# Altium project PCB_Project_1.PrjPcb
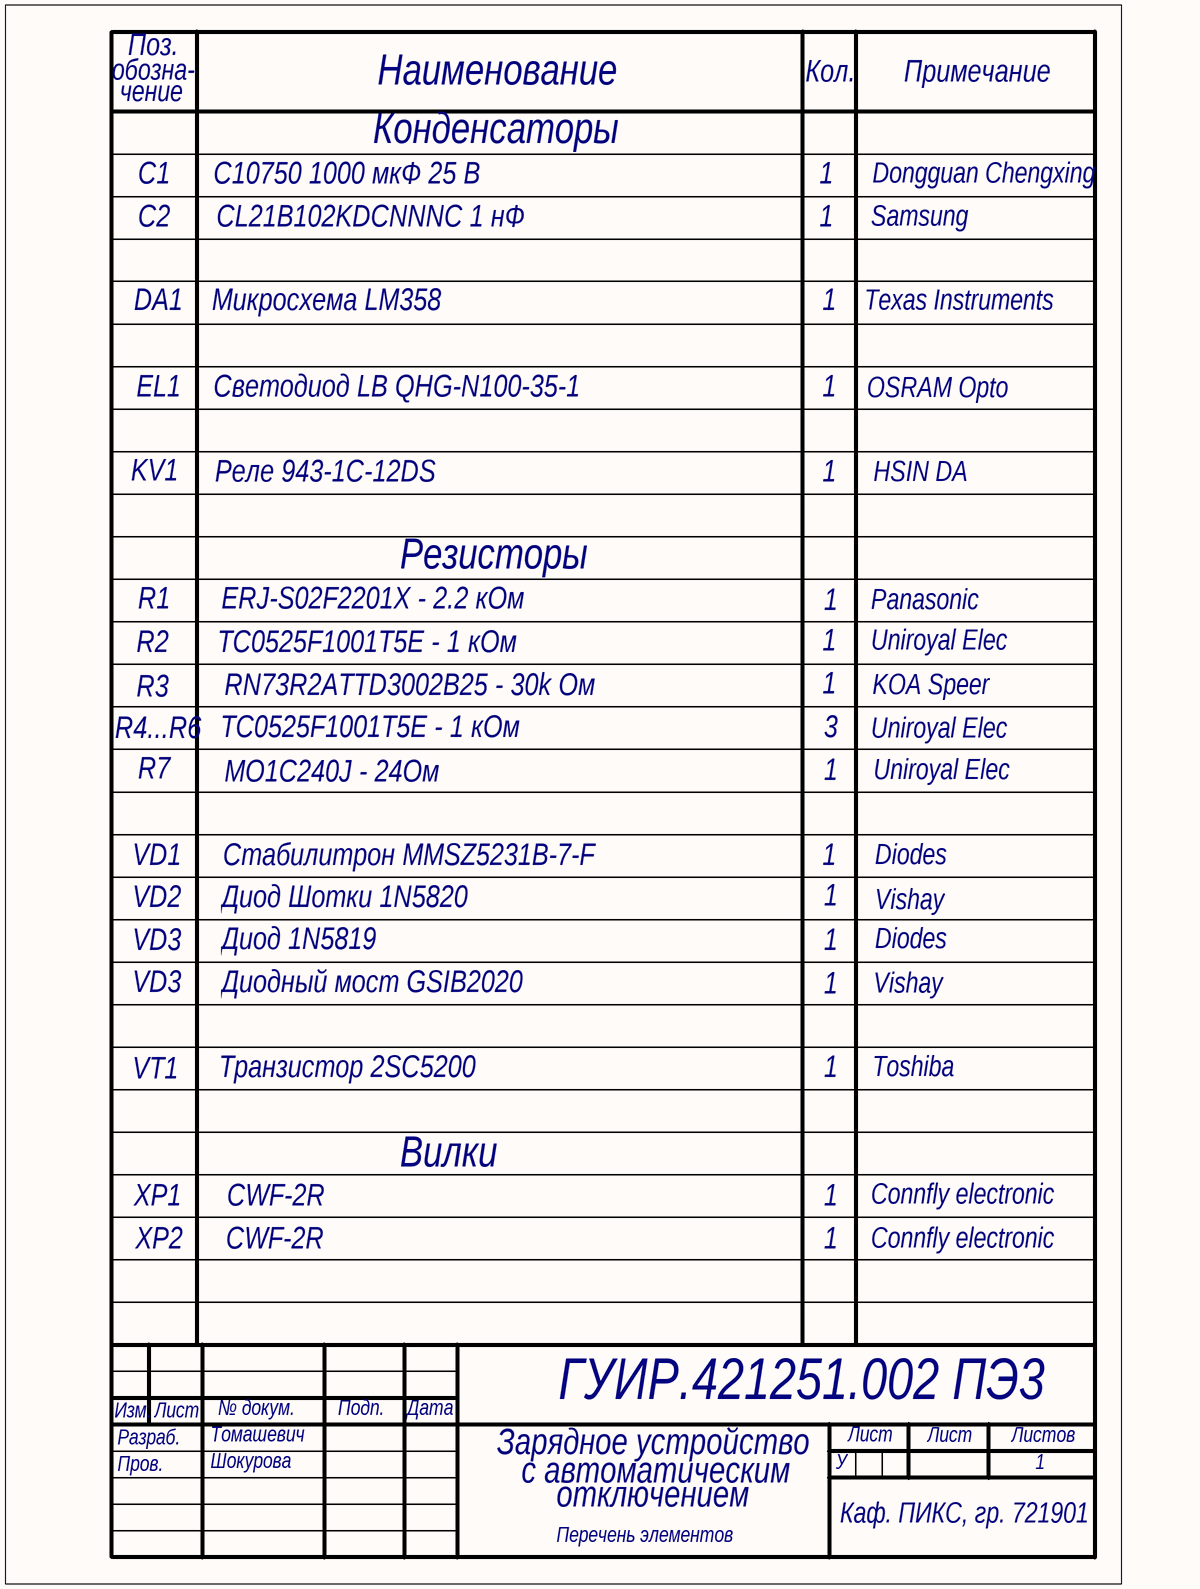
[diagram p0: Perechen_Elementov_KRAC_last.schdoc]
4 sheets, 41 parts. Net scope: global (net labels, ports and power ports of the same name join across sheets).
Sheets:
  Perechen_Elementov_KRAC_last.schdoc
  Perechen_Elementov_Kursovoy_PRT.schdoc
  dzmitry_tamashevich_schema.SchDoc
  Kursovoy_PRT.SchDoc

## Sheet Perechen_Elementov_KRAC_last.schdoc
size 209 x 297 mm

### Notes on the sheet
- Поз.
- обозна-
- чение
- Наименование
- Кол.
- Примечание
- С1
- C10750 1000 мкФ 25 В
- Конденсаторы
- 1
- Dongguan Chengxing
- С2
- CL21B102KDCNNNC 1 нФ
- Samsung
- DA1
- Микросхема LM358
- Texas Instruments
- EL1
- Светодиод LB QHG-N100-35-1
- OSRAM Opto
- KV1
- Реле 943-1C-12DS
- HSIN DA
- Резисторы
- R2
- R1
- TC0525F1001T5E - 1 кОм
- ERJ-S02F2201X - 2.2 кОм
- Uniroyal Elec
- Panasonic
- R3
- RN73R2ATTD3002B25 - 30k Ом
- KOA Speer
- R4...R6
- R7
- MO1C240J - 24Ом
- 3
- VD1
- Стабилитрон MMSZ5231B-7-F
- Diodes
- VD2
- Диод Шотки 1N5820
- Vishay
- VD3
- Диод 1N5819
- Диодный мост GSIB2020
- VT1
- Транзистор 2SC5200
- Toshiba
- Вилки
- Connfly electronic
- XP1
- XP2
- CWF-2R
- ГУИР.421251.002 ПЭ3
- Изм.
- Разраб.
- Пров.
- Лист
- Томашевич
- Шокурова
- № докум.
- Подп.
- Дата
- Зарядное устройство
- У
- Листов
- с автоматическим
- Перечень элементов
- отключением
- Каф. ПИКС, гр. 721901

## Sheet Perechen_Elementov_Kursovoy_PRT.schdoc
size 209 x 297 mm
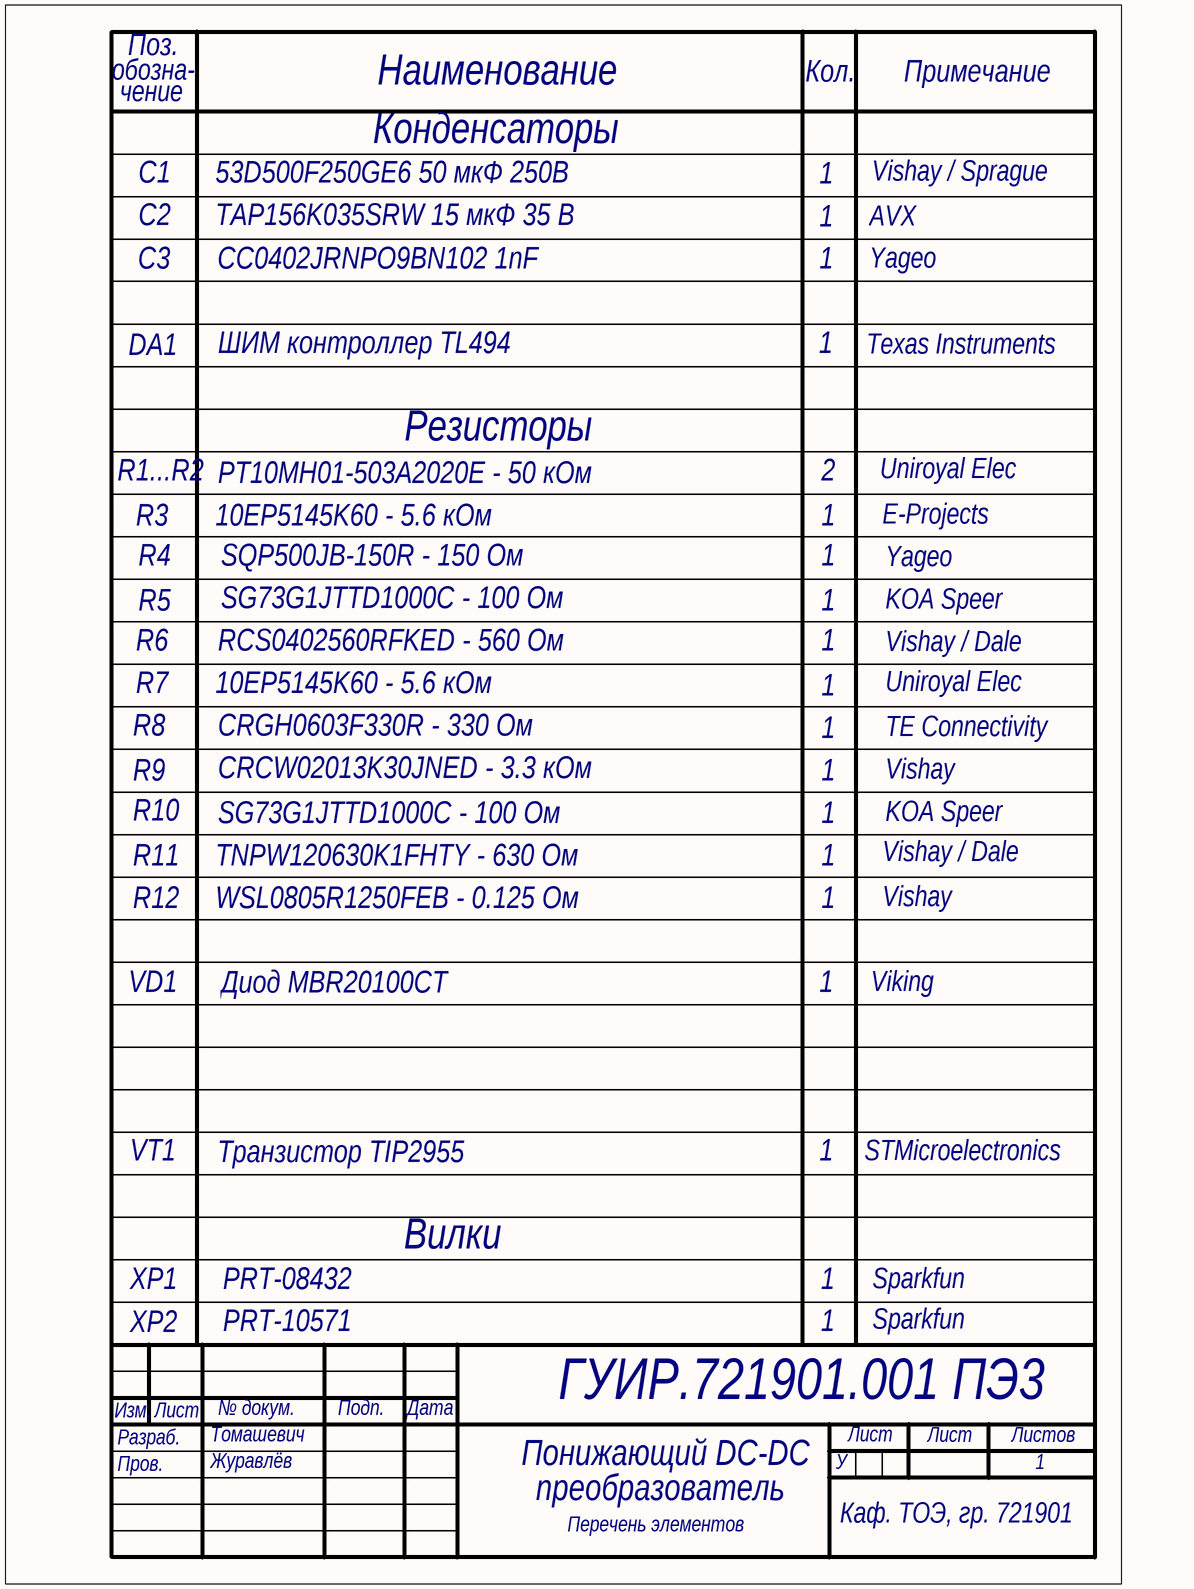
[diagram p1: Perechen_Elementov_Kursovoy_PRT.schdoc]

### Notes on the sheet
- Поз.
- обозна-
- чение
- Наименование
- Кол.
- Примечание
- С1
- 53D500F250GE6 50 мкФ 250В
- Конденсаторы
- 1
- Vishay / Sprague
- С2
- TAP156K035SRW 15 мкФ 35 В
- AVX
- С3
- CC0402JRNPO9BN102 1nF
- Yageo
- DA1
- ШИМ контроллер TL494
- Texas Instruments
- Резисторы
- R1...R2
- R3
- 10EP5145K60 - 5.6 кОм
- PT10MH01-503A2020E - 50 кОм
- 2
- Uniroyal Elec
- E-Projects
- R4
- SQP500JB-150R - 150 Ом
- R6
- R5
- RCS0402560RFKED - 560 Ом
- SG73G1JTTD1000C - 100 Ом
- KOA Speer
- Vishay / Dale
- R7
- R9
- R8
- CRGH0603F330R - 330 Ом
- CRCW02013K30JNED - 3.3 кОм
- TE Connectivity
- Vishay
- R10
- R11
- TNPW120630K1FHTY - 630 Ом
- R12
- WSL0805R1250FEB - 0.125 Ом
- VD1
- Диод MBR20100CT
- Viking
- VT1
- Транзистор TIP2955
- STMicroelectronics
- Вилки
- XP1
- XP2
- PRT-08432
- PRT-10571
- Sparkfun
- ГУИР.721901.001 ПЭ3
- Изм.
- Разраб.
- Пров.
- Лист
- Томашевич
- Журавлёв
- № докум.
- Подп.
- Дата
- Понижающий DC-DC
- У
- Листов
- преобразователь
- Перечень элементов
- Каф. ТОЭ, гр. 721901

## Sheet dzmitry_tamashevich_schema.SchDoc
size 420 x 297 mm; CheckedBy: Шокурова; Author: Томашевич; Address1: Address1; Address2: Address2; Address3: Address3; Address4: Address4; SheetTotal: 1; Scale: 1:1; Letter1Column: T
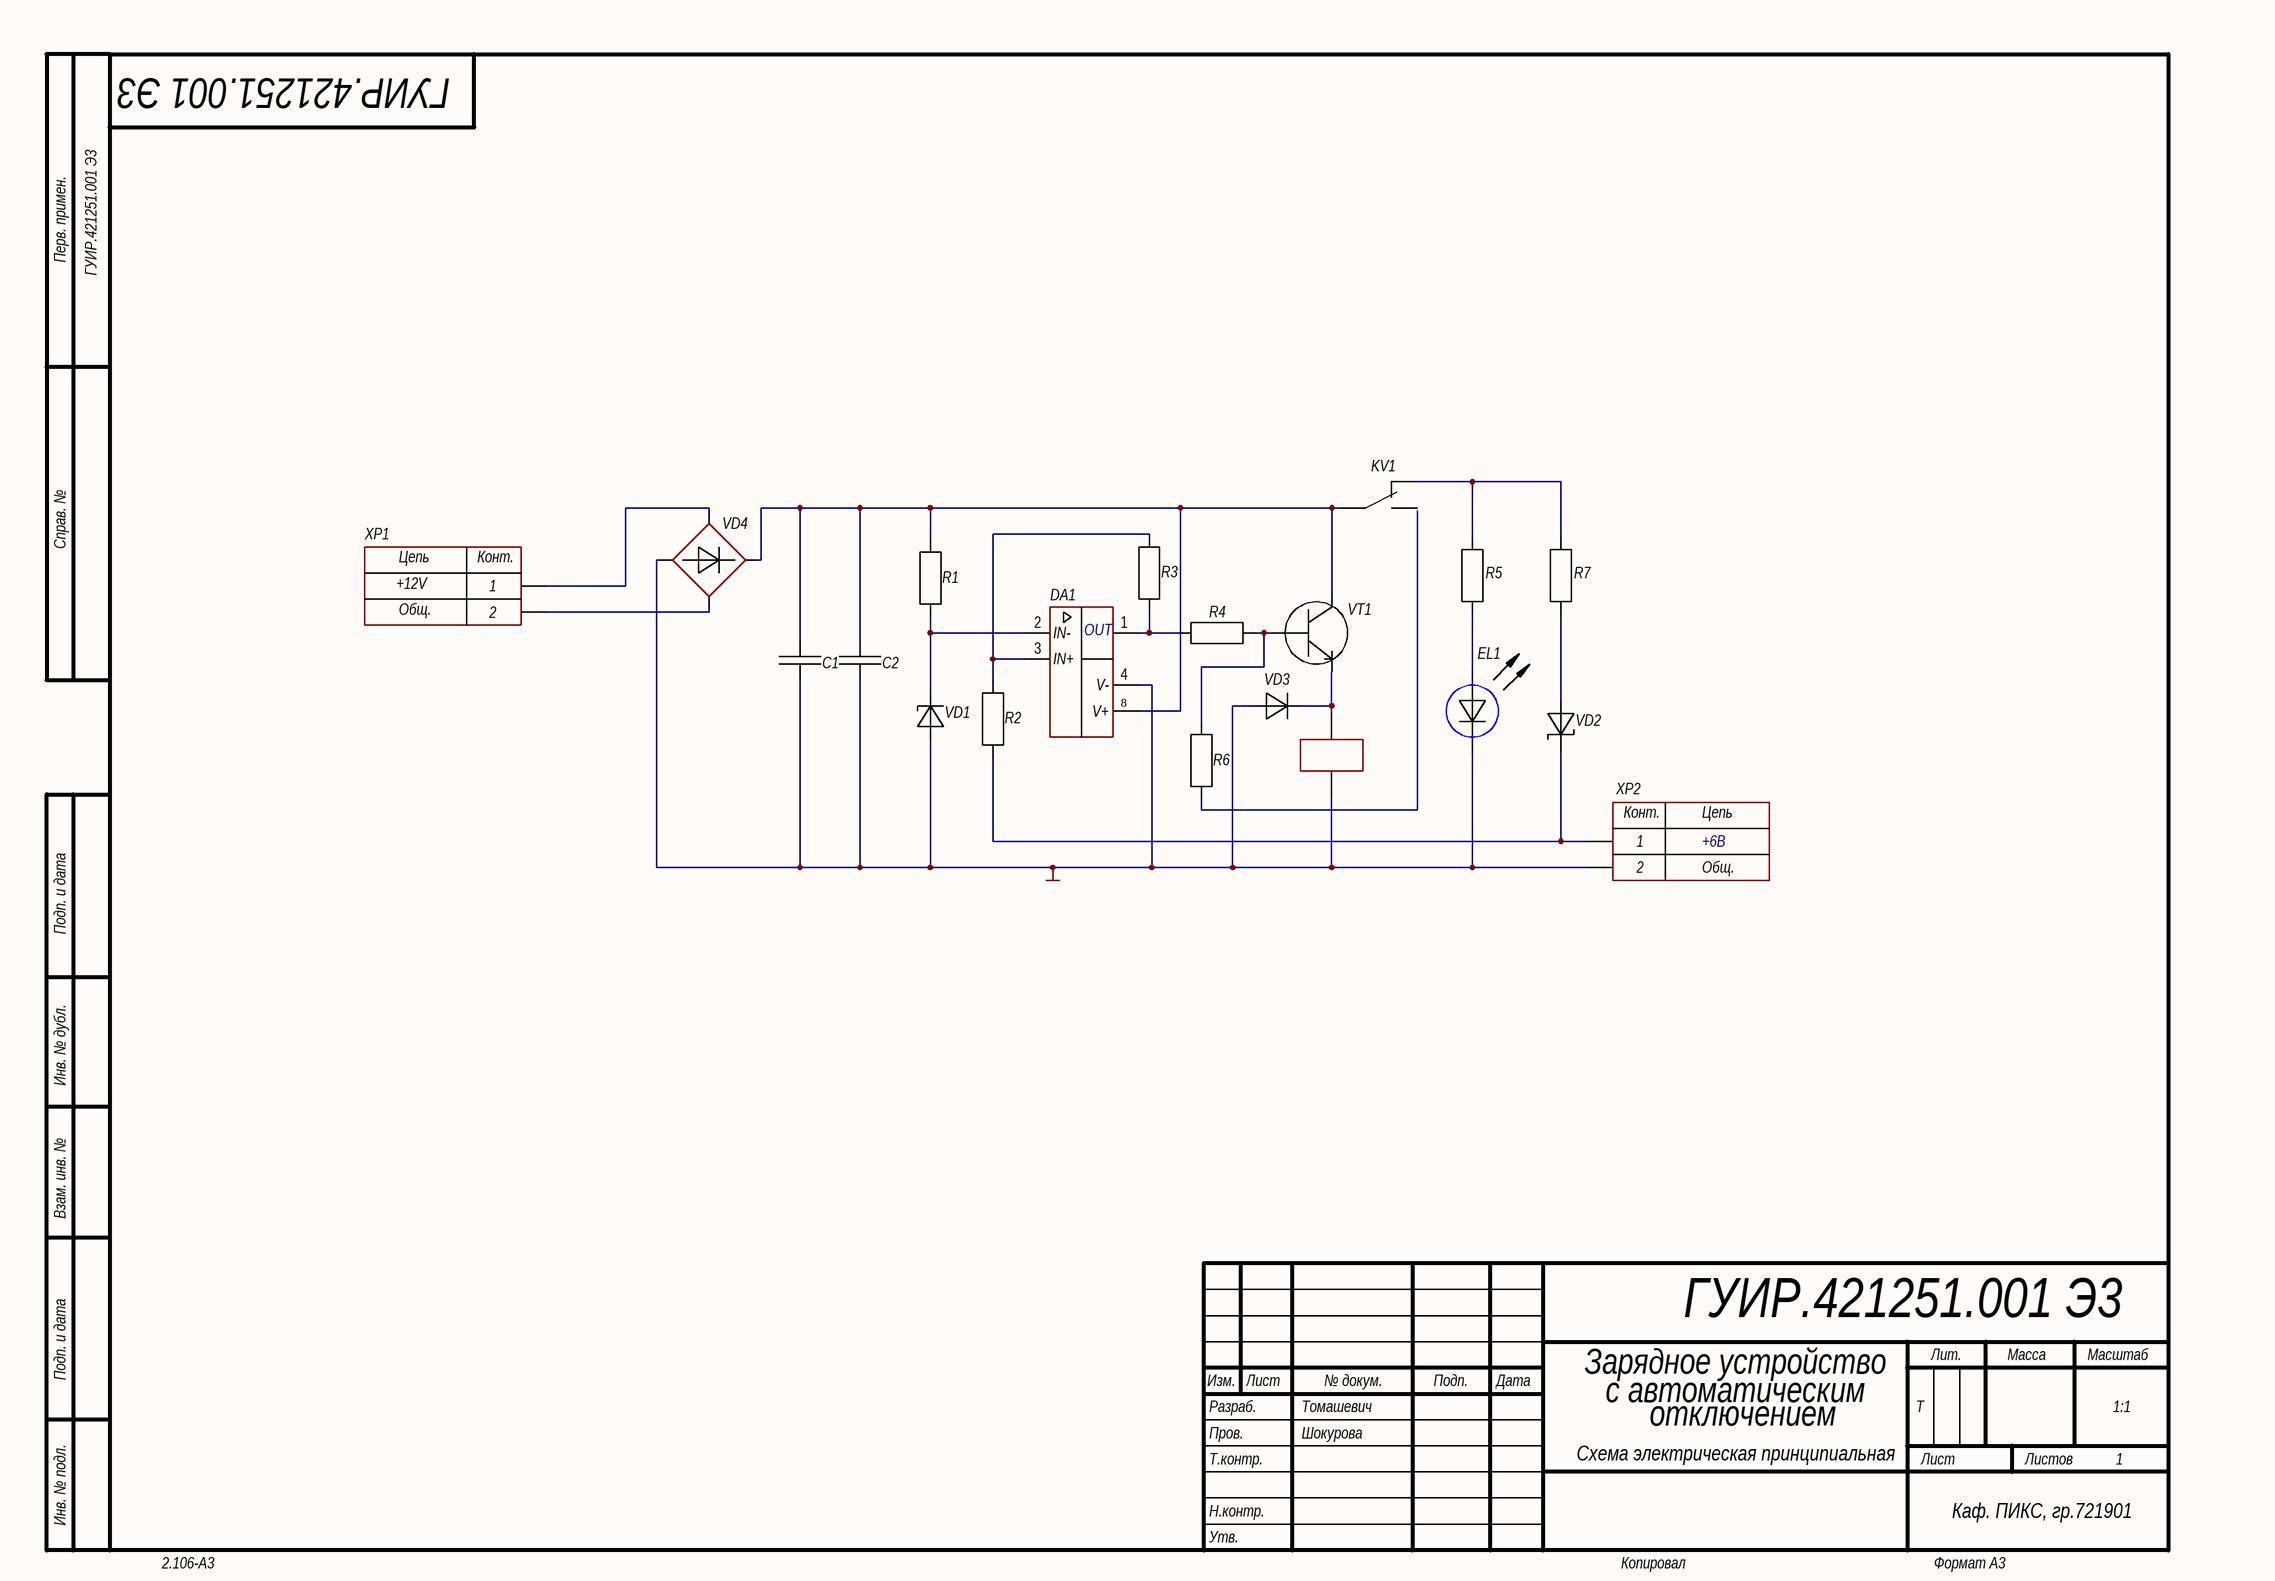
[diagram p2: dzmitry_tamashevich_schema.SchDoc]

### Parts
(Parts that share a designator on the sheet are numbered #1, #2 ... from top to bottom, then left to right.)
*#1  KV1
*#2  XP1
*#3  COMPONENT_1  (value not drawn)
C1#1  (no value)  [CAP: ECHU(X) D (2416)]
C2#1  (no value)  [CAP: ECHU(X) D (2416)]
DA1  (no value)  [SOT23-5]
EL1  (no value)  [LED: 0402B]
R1#1  *  [R1206]  (value not drawn)
R2#1  *  [R1206]  (value not drawn)
R3#1  *  [R1206]  (value not drawn)
R4#1  *  [R1206]  (value not drawn)
R5#1  *  [R1206]  (value not drawn)
R6#1  *  [R1206]  (value not drawn)
R7#1  *  [R1206]  (value not drawn)
VD1  (no value)  [DIODE: SMA]
VD2  (no value)  [DIODE: SMA]
VD3  (no value)  [DIODE: SMA]
VD4  (no value)  [DIODE: DF206S-G]
VT1#1  (no value)  [DPAK]
XP2#1  (no value)  [CON: 6PCV-02-006]

### Nets
GND: *#3.1 C1#1.2 C2#1.2 DA1.4(V-) EL1.2(C) VD1.1(A) VD3.1 VD4.1 XP2#1.2
Net*#1_3: *#1.3 C1#1.1 C2#1.1 DA1.8(V+) R1#1.2 VD4.3 VT1#1.1(B)
Net*#1_4: *#1.4 R5#1.2 R7#1.2
Net*#2_1: *#2.1 VD4.2
Net*#2_2: *#2.2 VD4.4
Net*#3_2: *#3.2 VD3.2 VT1#1.3(E)
NetDA1_1: DA1.1(OUT) R3#1.1 R4#1.1
NetDA1_2: DA1.2(IN-) R1#1.1 VD1.2(C)
NetDA1_3: DA1.3(IN+) R2#1.2 R3#1.2
NetEL1_1: EL1.1(A) R5#1.1
NetR2#1_1: R2#1.1 VD2.2 XP2#1.1
NetR4#1_2: R4#1.2 R6#1.2 VT1#1.2(C)
NetR7#1_1: R7#1.1 VD2.1

Not connected (* = marked no-connect by the designer): *#1 5; DA1 5 6 7; R6#1 1

### Notes on the sheet
- ГУИР.421251.001 Э3
- +12V
- (near DA1) OUT
- +6В
- Зарядное устройство
- Схема электрическая принципиальная
- с автоматическим
- отключением
- Каф. ПИКС, гр.721901
- Перв. примен.
- Справ. №
- Подп. и дата
- Инв. № дубл.
- Взам. инв. №
- Разраб.
- Изм.
- Лист
- № докум.
- Подп.
- Дата
- Лит.
- Масса
- Масштаб
- Пров.
- Т.контр.
- Листов
- Инв. № подл.
- Утв.
- Н.контр.
- 2.106-A3
- Копировал
- Формат А3
- (in symbol Connector_6PCV-02) Конт.; Цепь; Общ.
- (in symbol MY_connector) Цепь; Конт.; Общ.

### Library data of the parts
*#1 = my2
*#2 = MY_connector
*#3 = my1
C1#1 C2#1 = Film_SMD: Manufacturer: Panasonic Electronic Components; PartNumber: ECH-U1H104JX9; ValueManufacturerPartNumber: Film capacitor, 0.1µF, 50VDC, ±5%, *, 1913, -55...+125°C; TypeCapacitor: Film capacitor; Tolerance: ±5%; Voltage: 50VDC; Value: 0.1µF; Package: 1913; HelpURL: https://www.digikey.com/product-detail/en/panasonic-electronic-components/ECH-U1H104JX9/PCF1561CT-ND/1630924; Temperature: -55...+125°C; Impedance: *
DA1 = LM358: OP amplifier; Manufacturer: Texas Instruments; ValueManufacturerPartNumber: IC op amplifier, Rail-to-Rail, 1 MHz, 2.7...5.5V, -40...+125°C, SOT23-5; PartNumber: LMV321IDBVR; Supply: 2.7...5.5V; OutputType: Rail-to-Rail; GainBandwidth: 1 MHz; HelpURL: https://www.digikey.com/product-detail/en/texas-instruments/LMV321IDBVR/296-9567-1-ND/379849; Package: SOT23-5; ComponentType: IC op amplifier; Temperature: -40...+125°C
EL1 = LED_single: ValueManufacturerPartNumber: LED, Green, *, *, *, -55...+150°C; TypeDiode: LED; ColorParameter: Green; Manufacturer: *; Package: *; HelpURL: *; Temperature: -55...+150°C; Current: *; VoltageDrop: *; PartNumber: *; Color: GREEN
R1#1 R2#1 R3#1 R4#1 R5#1 R6#1 R7#1 = MyResistor: Model: *; Manufacture: *; Case: *; Help URL: *; Value: *
VD1 = Zener_single: Manufacturer: Diodes Incorporated; ValueManufacturerPartNumber: Zener diode, 5.1V, 500mW, 0.9V, 17Ohm, SOD-123, -55...+150°C; PartNumber: MMSZ5231B-7-F; TypeDiode: Zener diode; Current: 500mW; VoltageDrop: 0.9V; RecoveryTime: 17Ohm; Voltage: 5.1V; Package: SOD-123; HelpURL: https://www.digikey.com/product-detail/en/diodes-incorporated/MMSZ5231B-7-F/MMSZ5231B-FDICT-ND/755506; Temperature: -55...+150°C
VD2 = Schottky_single: Manufacturer: Diodes Incorporated; ValueManufacturerPartNumber: Schottky diode, 80V, 500mA, 1V, 15pF, SOD-123, -55...+150°C; PartNumber: MBR0580S1-7; TypeDiode: Schottky diode; Voltage: 80V; Current: 500mA; VoltageDrop: 1V; RecoveryTime: 15pF; Package: SOD-123; HelpURL: https://www.digikey.com/product-detail/en/diodes-incorporated/MBR0580S1-7/MBR0580S1-7DICT-ND/5080371; Temperature: -55...+150°C
VD3 = Diode_single: Manufacturer: Micro Commercial; ValueManufacturerPartNumber: Single diode, 75V, 150mA, 1V, 4ns, SOD-323, -55...+150°C; PartNumber: 1N4148WX-TP; TypeDiode: Single diode; Voltage: 75V; Current: 150mA; VoltageDrop: 1V; RecoveryTime: 4ns; Package: SOD-323; HelpURL: https://www.digikey.com/product-detail/en/micro-commercial-co/1N4148WX-TP/1N4148WXTPMSCT-ND/717312; Temperature: -55...+150°C
VD4 = 1PH rectifier: Manufacturer: Comchip Technology; ValueManufacturerPartNumber: Single phase rectifier, 600V, 2A, 1.1V, 4-SMD, -55...+150°C; PartNumber: DF206ST-G; TypeDiode: Single phase rectifier; Voltage: 600V; Current: 2A; VoltageDrop: 1.1V; Package: 4-SMD; HelpURL: https://www.digikey.com/product-detail/en/comchip-technology/DF206ST-G/641-1425-1-ND/2208797; Temperature: -55...+150°C
VT1#1 = BJT_NPN_123: Manufacturer: ON Semiconductor; ValueManufacturerPartNumber: NPN transistor, 45V, 100mA, 100MHz, 300mW, 0.6V, 420, SOT-23, -55...+125°C; PartNumber: BC847CLT1G; TypeTransistor: NPN transistor; VoltageCE: 45V; CurrentCE: 100mA; VoltageSaturation: 0.6V; Frequency: 100MHz; CurrentGain: 420; MaxPower: 300mW; Package: SOT-23; HelpURL: https://www.digikey.com/product-detail/en/on-semiconductor/BC847CLT1G/BC847CLT1GOSCT-ND/917836; Temperature: -55...+125°C
XP2#1 = Connector_6PCV-02: Manufacturer: TE Connectivity; ValueManufacturerPartNumber: Connector, 2pin, 9.53mm, 300VAC, 25A; PartNumber: 6PCV-02-006; VoltageMax: 300VAC; Pitch: 9.53mm; CurrentMax: 25A; Multichannel: 2pin; HelpURL: https://www.digikey.com/products/en?keywords=6PCV-02-006; TypeConnector: Connector

## Sheet Kursovoy_PRT.SchDoc
size 420 x 297 mm; CheckedBy: Журавлёв; Author: Томашевич; CompanyName: Каф. ТОЭ, гр. 721901; Address1: Address1; Address2: Address2; Address3: Address3; Address4: Address4; DocumentNumber: ГУИР.721901.001 Э3; SheetTotal: 1; Scale: 1:1; Title2str: DC-DC Преобразователь; DocumentType: понижающего типа; FirstReferrence: ГУИР.721901.001
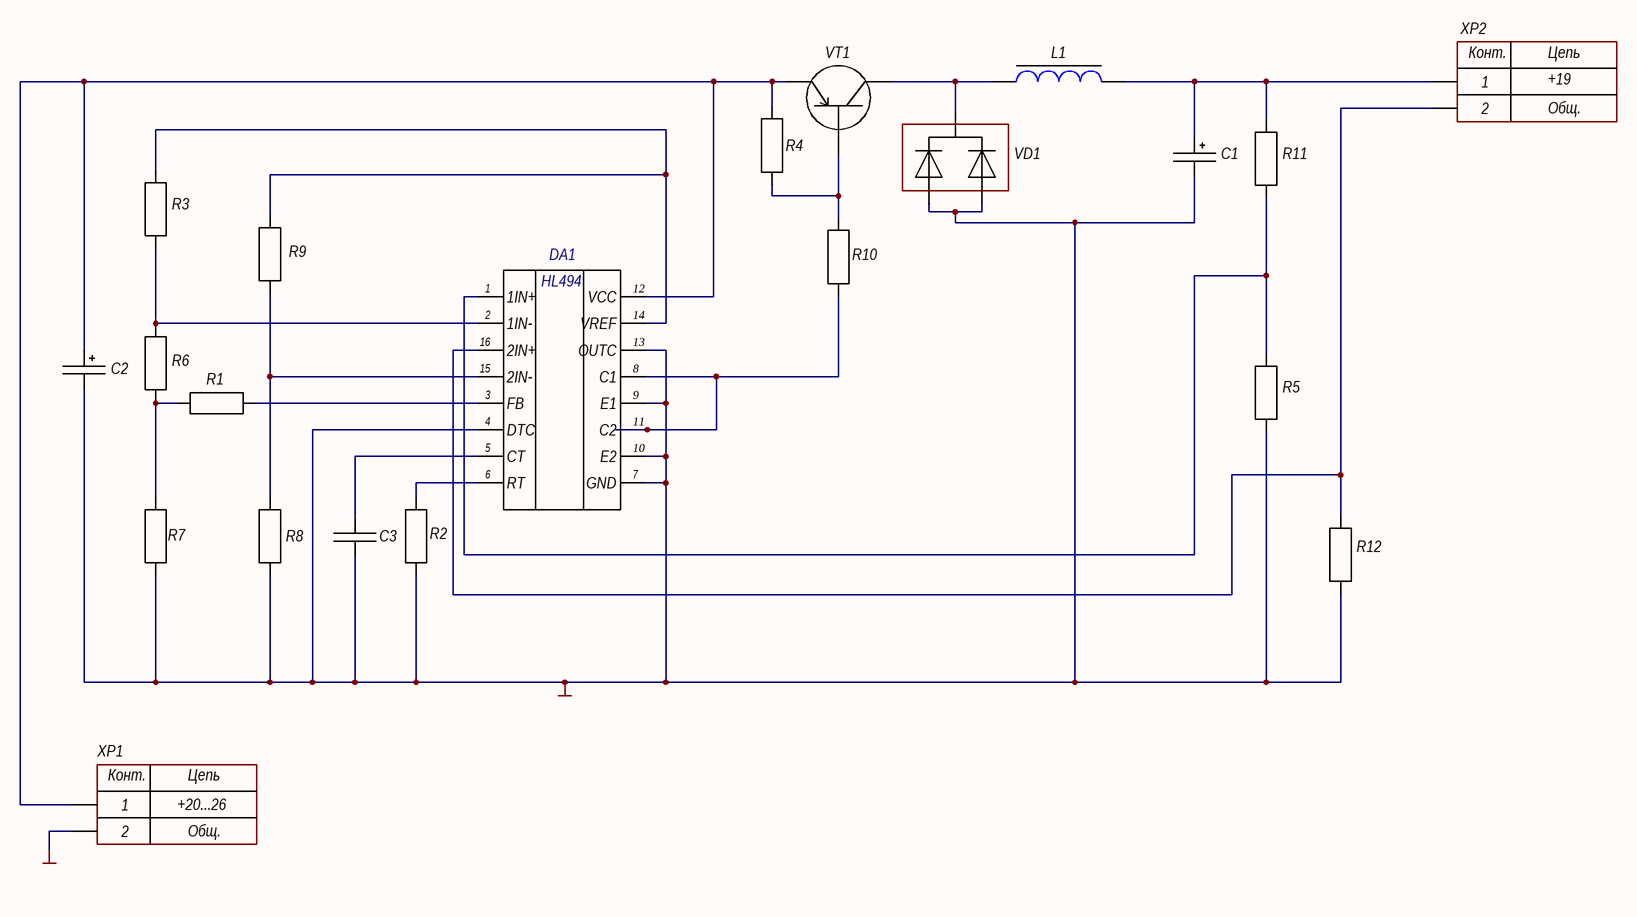
[diagram p3: Kursovoy_PRT.SchDoc]

### Parts
(Parts that share a designator on the sheet are numbered #1, #2 ... from top to bottom, then left to right.)
*?  DA1
?  VD1
C1#2  (no value)  [CAP: TANTAL-A]
C2#2  (no value)  [CAP: TANTAL-A]
C3  (no value)  [CAP: ECHU(X) D (2416)]
L1  (no value)  [IND: 0201]
R1#2  *  [R1206]  (value not drawn)
R2#2  *  [R1206]  (value not drawn)
R3#2  *  [R1206]  (value not drawn)
R4#2  *  [R1206]  (value not drawn)
R5#2  *  [R1206]  (value not drawn)
R6#2  *  [R1206]  (value not drawn)
R7#2  *  [R1206]  (value not drawn)
R8  *  [R1206]  (value not drawn)
R9  *  [R1206]  (value not drawn)
R10  *  [R1206]  (value not drawn)
R11  *  [R1206]  (value not drawn)
R12  *  [R1206]  (value not drawn)
VT1#2  (no value)  [D2PAK]
XP1  (no value)  [CON: 6PCV-02-006]
XP2#2  (no value)  [CON: 6PCV-02-006]

### Nets
GND: *?.4(DTC) *?.7(GND) *?.9(E1) *?.10(E2) *?.13(OUTC) ?.1 ?.2 C1#2.2 C2#2.2 C3.2 R2#2.1 R5#2.1 R7#2.1 R8.1 R12.1 XP1.2
Net*?_1: *?.1(1IN+) R5#2.2 R11.1
Net*?_2: *?.2(1IN-) R3#2.2 R6#2.2
Net*?_3: *?.3(FB) R1#2.1
Net*?_5: *?.5(CT) C3.1
Net*?_6: *?.6(RT) R2#2.2
Net*?_8: *?.8(C1) *?.11(C2) R10.1
Net*?_12: *?.12(VCC) C2#2.1 R4#2.2 VT1#2.2 XP1.1
Net*?_14: *?.14(VREF) R3#2.1 R9.2
Net*?_15: *?.15(2IN-) R8.2 R9.1
Net*?_16: *?.16(2IN+) R12.2 XP2#2.2
Net?_3: ?.3 L1.2 VT1#2.3
NetC1#2_1: C1#2.1 L1.1 R11.2 XP2#2.1
NetR1#2_2: R1#2.2 R6#2.1 R7#2.2
NetR4#2_1: R4#2.1 R10.2 VT1#2.1

### Notes on the sheet
- +19
- +20...26
- Перв. примен.
- Справ. №
- Подп. и дата
- Инв. № дубл.
- Взам. инв. №
- Разраб.
- Изм.
- Лист
- № докум.
- Подп.
- Дата
- Лит.
- Масса
- Масштаб
- Пров.
- Т.контр.
- Листов
- Инв. № подл.
- Утв.
- Н.контр.
- 2.106-A3
- Копировал
- Формат А3
- (in symbol Connector_6PCV-02) Конт.; Цепь; Общ.

### Library data of the parts
*? = HL494
? = DIOD_ARRAY_MBR20100CT
C1#2 C2#2 = Tantal_A: Manufacturer: AVX; PartNumber: F930J107KAAAJ6; ValueManufacturerPartNumber: Tantalum capacitor, 100μF, 6.3V, ±10%, 2Ohm, case A (3216), -55...+125°C; Impedance: 2Ohm; Tolerance: ±10%; TypeDielectric: X7R; TypeCapacitor: Tantalum capacitor; Voltage: 6.3V; Value: 100μF; Package: case A (3216); HelpURL: https://www.digikey.com/product-detail/en/avx-corporation/F930J107KAAAJ6/478-12404-1-ND/9645231; Temperature: -55...+125°C
C3 = Film_SMD: as C1#1 on sheet dzmitry_tamashevich_schema; Package: 1913; HelpURL: https://www.digikey.com/product-detail/en/panasonic-electronic-components/ECH-U1H104JX9/PCF1561CT-ND/1630924; Temperature: -55...+125°C; Impedance: *
L1 = Inductor_0201: Manufacturer: Murata Electronics; PartNumber: LQP03TNR10J02D; ValueManufacturerPartNumber: Fixed inductor, 100nH, ±5%, 0201, 80mA, -55...+125°C; TypeInductor: Fixed inductor; MaxCurrent: 80mA; Tolerance: ±5%; Value: 100nH; Package: 0201; HelpURL: https://www.digikey.com/product-detail/en/murata-electronics-north-america/LQP03TNR10J02D/490-6742-1-ND/3845939; Temperature: -55...+125°C
R1#2 R2#2 R3#2 R4#2 R5#2 R6#2 R7#2 R8-R12 = MyResistor: Model: *; Manufacture: *; Case: *; Help URL: *; Value: *
VT1#2 = BJT_PNP_123: Manufacturer: ON Semiconductor; ValueManufacturerPartNumber: PNP transistor, 45V, 100mA, 100MHz, 300mW, 0.65V, 220, SOT-23, -55...+125°C; PartNumber: BC857BLT3G; TypeTransistor: PNP transistor; VoltageCE: 45V; CurrentCE: 100mA; VoltageSaturation: 0.65V; Frequency: 100MHz; CurrentGain: 220; MaxPower: 300mW; Package: SOT-23; HelpURL: https://www.digikey.com/product-detail/en/on-semiconductor/BC857BLT3G/BC857BLT3GOSCT-ND/2704963; Temperature: -55...+125°C
XP1 XP2#2 = Connector_6PCV-02: as XP2#1 on sheet dzmitry_tamashevich_schema; HelpURL: https://www.digikey.com/products/en?keywords=6PCV-02-006; TypeConnector: Connector

## Nets that join several sheets
GND: dzmitry_tamashevich_schema (9 pins), Kursovoy_PRT (16 pins)